# Altium schematic sheet RelayExtension.SchDoc: PCB-Tester Relay Extension
size A4; Date: JUN 2020; CheckedBy: Moerz, Hoeren; Author: Rudziński; CompanyName: TDK-Micronas GmbH; DrawnBy: Rudziński; Engineer: Rudziński; Organization: Test Engineering; Address1: Hans-Bunte-Strasse 19; Address2: D-79108 Freiburg; Address3: Germany; DocumentNumber: U33110; Revision: V1.0; SheetNumber: 19; SheetTotal: 20; DateDraw: JUN 2020; DateChecked: 2020-06-19; Workspace: Workspace; TitleTyp: Title-Typ; PageSetup: Record=PageOptions|CenterHorizontal=True|CenterVertical=True|PrintScale=0.97|XCorrection=1.00|YCorrection=1.00|PrintKind=0|BorderSize=5000000|LeftOffset=0|BottomOffset=0|Orientation=2|PaperLength=1000|PaperWidth=1000|Scale=100|PaperSource=7|PrintQuality=-3|MediaType=1|DitherType=10|PrintScaleMode=1|PaperKind=A4|PaperIndex=9
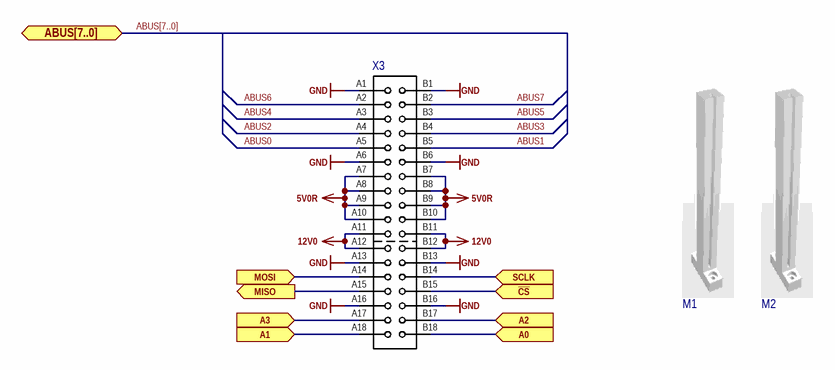
[diagram p0: RelayExtension.SchDoc]

## Parts
M1  PCB Support  [PCB Tester Support]  (value not drawn)
M2  PCB Support  [PCB Tester Support]  (value not drawn)
X3  X  [PCIE-036-02-F-D-TH]  (value not drawn)

## Ports
A0 (in), A1 (in), A2 (in), A3 (in), ABUS[7..0] (bidir), MISO (out), MOSI (in), SCLK (in), ~{CS} (in)

## Nets
5V0R: X3.A7 X3.A8 X3.A9 X3.A10 X3.B7 X3.B8 X3.B9 X3.B10
12V0: X3.A11 X3.A12 X3.B11 X3.B12
GND: X3.A1 X3.A6 X3.A13 X3.A16 X3.B1 X3.B6 X3.B13 X3.B16
~{CS}: X3.B15 ; port ~{CS}
A0: X3.B18 ; port A0
A1: X3.A18 ; port A1
A2: X3.B17 ; port A2
A3: X3.A17 ; port A3
ABUS0: X3.A5
ABUS1: X3.B5
ABUS2: X3.A4
ABUS3: X3.B4
ABUS4: X3.A3
ABUS5: X3.B3
ABUS6: X3.A2
ABUS7: X3.B2
MISO: X3.A15 ; port MISO
MOSI: X3.A14 ; port MOSI
SCLK: X3.B14 ; port SCLK

## Buses and harness runs
bus ABUS[7..0] = port ABUS[7..0]

## Notes on the sheet
- designed by
- reviewed by
- last drawn by
- Project:
- Schematic:
- last printed
- DIN-A4 L
- sheets
- of
- File:

## Library data of the parts
M1 M2 = PCB Tester Support: 04. Manufacturer: Likom; 07. Manufacturer  Part Number: TBD; 03. Unit Price: 15.0; 13. Created Date/Name: ??? / Hören; System: Connector; 01. Distributor: N/A; 02. Distributor Part Number: N/A; ComponentLink1Description: Info; ComponentLink2Description: DataSheet
X3 = PCIE-036-02-F-D-TH: CONN PCI EXP FMALE 36POS 0.039; 04. Manufacturer: Samtec Inc.; 03. Unit Price: 1.76; 13. Created Date/Name: ??? / Hören; System: Connector; 01. Distributor: DigiKey; 02. Distributor Part Number: SAM10625-ND; 07. Manufacturer  Part Number: PCIE-036-02-F-D-TH; ComponentLink1Description: Info; ComponentLink1URL: https://www.digikey.de/products/en?keywords=PCIE-036-02-F-D-TH; ComponentLink2Description: DataSheet; ComponentLink2URL: http://suddendocs.samtec.com/catalog_english/pcie.pdf